# EAGLE design kicker (EAGLE 9.5.1)
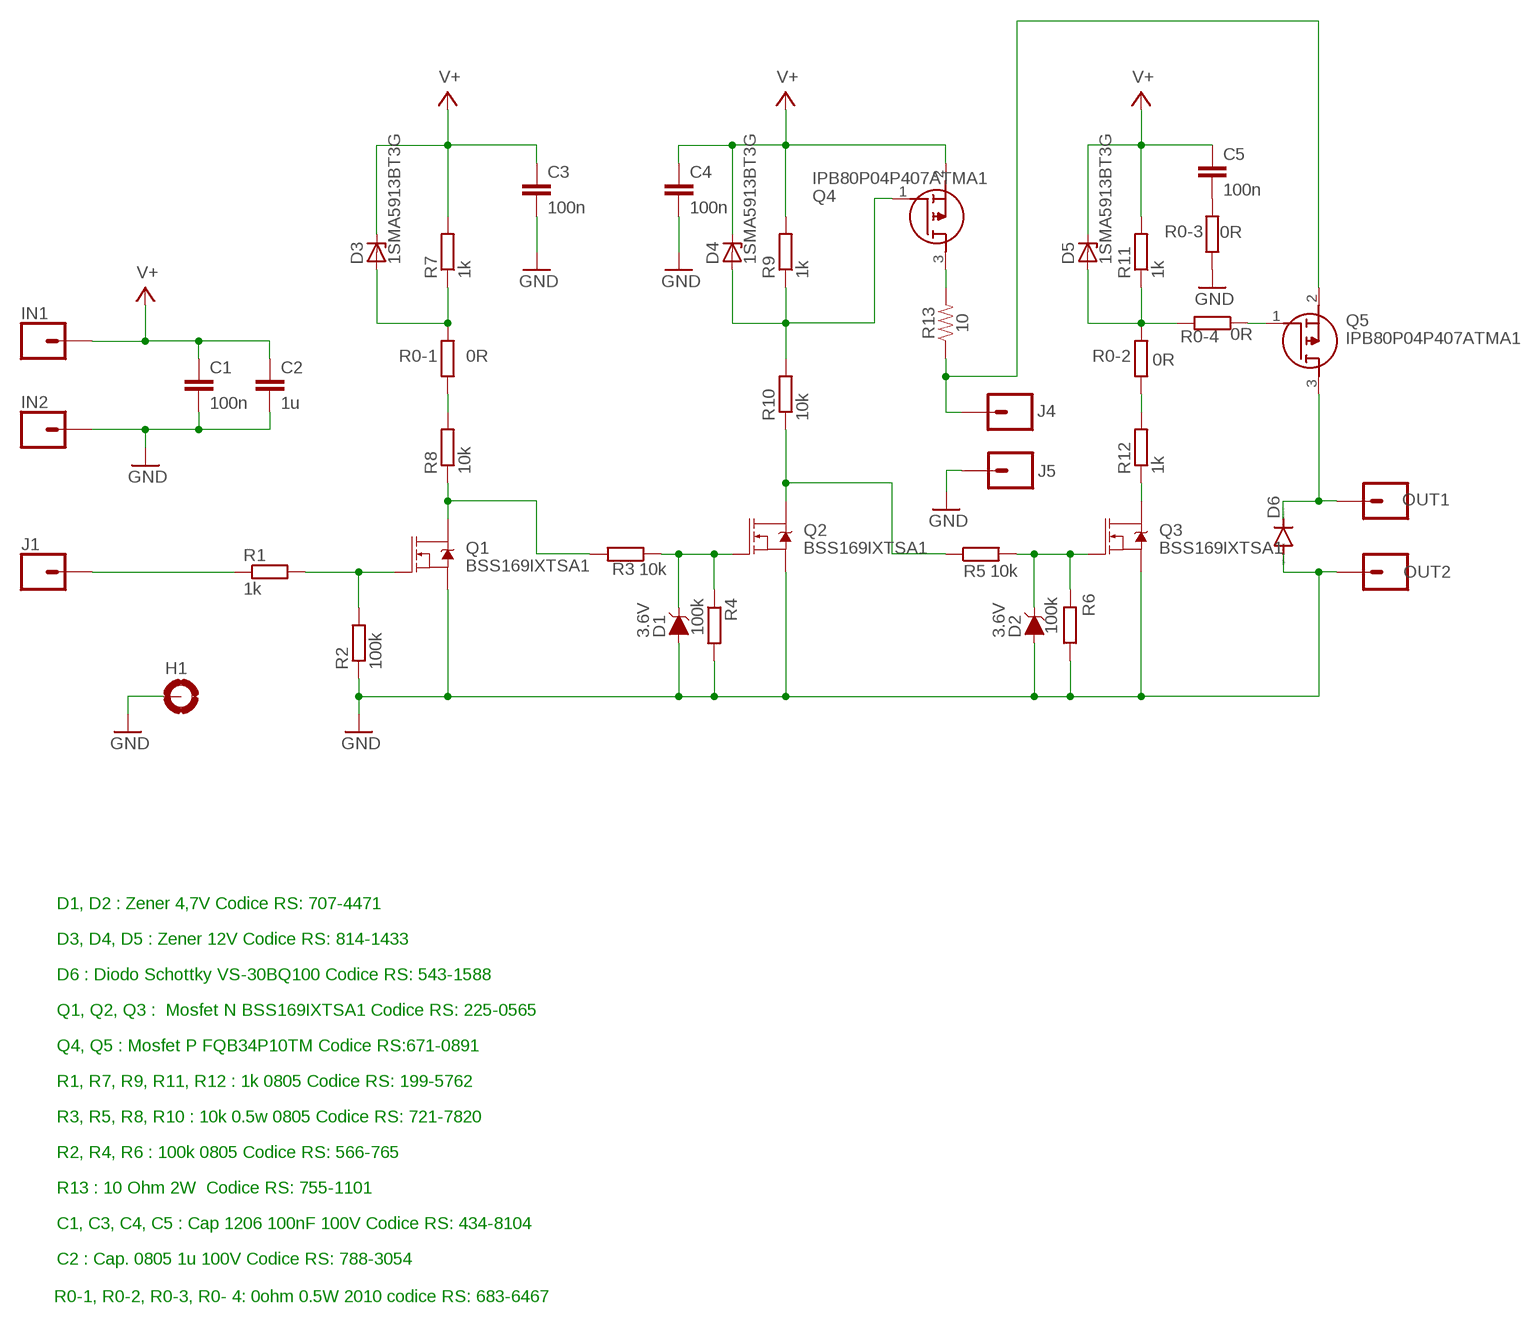
[diagram p0: schematic, sheet 1]

## Parts
C1  100n  C-EUC1206  [C1206]
C2  1u  C-EUC1206  [C1206]
C3  100n  C-EUC1206  [C1206]
C4  100n  C-EUC1206  [C1206]
C5  100n  C-EUC1206  [C1206]
D1  3.6V  DIODE-ZENER-BZT52C3V6S  [SOD-323]
D2  3.6V  DIODE-ZENER-BZT52C3V6S  [SOD-323]
D3  1SMA5913BT3G  [DO214AC]
D4  1SMA5913BT3G  [DO214AC]
D5  1SMA5913BT3G  [DO214AC]
D6  DIODE-SMC  [SMC]
H1  MOUNT-PAD-ROUND3.0  [3,0-PAD]
IN1  CONN_01  [1X01]
IN2  CONN_01  [1X01]
J1  CONN_01  [1X01]
J4  CONN_01  [1X01]
J5  CONN_01  [1X01]
OUT1  CONN_01  [1X01]
OUT2  CONN_01  [1X01]
Q1  BSS169IXTSA1  MOSFET-NCH-AO3404A  [SOT23-3]
Q2  BSS169IXTSA1  MOSFET-NCH-AO3404A  [SOT23-3]
Q3  BSS169IXTSA1  MOSFET-NCH-AO3404A  [SOT23-3]
Q4  IPB80P04P407ATMA1  [PG-TO263-3-2_1]
Q5  IPB80P04P407ATMA1  [PG-TO263-3-2_1]
R0-1  0R  R-EU_R2010  [R2010]
R0-2  0R  R-EU_R2010  [R2010]
R0-3  0R  R-EU_R2010  [R2010]
R0-4  0R  R-EU_R2010  [R2010]
R1  1k  R-EU_R1206  [R1206]
R2  100k  R-EU_R1206  [R1206]
R3  10k  R-EU_R1206  [R1206]
R4  100k  R-EU_R1206  [R1206]
R5  10k  R-EU_R1206  [R1206]
R6  100k  R-EU_R1206  [R1206]
R7  1k  R-EU_R1206  [R1206]
R8  10k  R-EU_R1206  [R1206]
R9  1k  R-EU_R1206  [R1206]
R10  10k  R-EU_R1206  [R1206]
R11  1k  R-EU_R1206  [R1206]
R12  1k  R-EU_R1206  [R1206]
R13  10  0.1OHM-1210-1/2W-1%  [1210]

## Nets
GND: C1.2 C2.2 C3.2 C4.2 D1.A D2.A D6.A H1.B3,0(MOUNT) IN2.1 J5.1 OUT2.1 Q1.2(S) Q2.2(S) Q3.2(S) R0-3.1 R2.1 R4.2 R6.1
N$1: J1.1 R1.1
N$2: Q1.1(G) R1.2 R2.2
N$3: D1.C Q2.1(G) R3.1 R4.1
N$4: D2.C Q3.1(G) R5.2 R6.2
N$5: Q1.3(D) R3.2 R8.1
N$6: R0-1.1 R8.2
N$7: Q2.3(D) R5.1 R10.1
N$8: D4.A Q4.1(G) R9.1 R10.2
N$9: Q4.3(D) R13.2
N$10: D3.A R0-1.2 R7.1
N$11: D6.C OUT1.1 Q5.3(D)
N$12: J4.1 Q5.2(S) R13.1
N$13: R0-2.1 R12.2
N$14: C5.2 R0-3.2
N$15: D5.A R0-2.2 R0-4.2 R11.1
N$16: Q3.3(D) R12.1
N$17: Q5.1(G) R0-4.1
V+: C1.1 C2.1 C3.1 C4.1 C5.1 D3.C D4.C D5.C IN1.1 Q4.2(S) R7.2 R9.2 R11.2

## Notes on the sheet
- D1, D2 : Zener 4,7V Codice RS: 707-4471
- D3, D4, D5 : Zener 12V Codice RS: 814-1433
- D6 : Diodo Schottky VS-30BQ100 Codice RS: 543-1588
- Q1, Q2, Q3 :  Mosfet N BSS169IXTSA1 Codice RS: 225-0565
- Q4, Q5 : Mosfet P FQB34P10TM Codice RS:671-0891
- R1, R7, R9, R11, R12 : 1k 0805 Codice RS: 199-5762
- R3, R5, R8, R10 : 10k 0.5w 0805 Codice RS: 721-7820
- R2, R4, R6 : 100k 0805 Codice RS: 566-765
- R13 : 10 Ohm 2W  Codice RS: 755-1101
- C1, C3, C4, C5 : Cap 1206 100nF 100V Codice RS: 434-8104
- C2 : Cap. 0805 1u 100V Codice RS: 788-3054
- R0-1, R0-2, R0-3, R0- 4: 0ohm 0.5W 2010 codice RS: 683-6467

## Library data of the parts
C1-C5 = rcl:C-EU: CAPACITOR, European symbol; SPICEPREFIX: C
D1 D2 = SparkFun-DiscreteSemi:DIODE-ZENER: Zener Diode A Zener diode allows current to flow from its anode to its cathode like a normal semiconductor diode, but it also permits current to flow in the reverse direction when its "Zener voltage" is reached. - WIkipedia; PROD_ID: DIO-08199
D3-D5 = 1sma59xx_10:1SMA59*BT3G: 1SMA59xxBT3G Series 1.5 Watt Plastic Surface Mount Zener Voltage Regulators Source: http://www.onsemi.com/pub_link/Collateral/1SMA5913BT3-D.PDF; MF: ON Semiconductor; MPN: 1SMA5913BT3G; OC_FARNELL: 1431138; OC_NEWARK: 26K5252
D6 = diode:DIODE-: DIODE
H1 = holes:MOUNT-PAD-ROUND: MOUNTING PAD, round
IN1 IN2 J1 J4 J5 OUT1 OUT2 = SparkFun-Connectors:CONN_01: Single connection point. Often used as Generic Header-pin footprint for 0.1 inch spaced/style header connections On any of the 0.1 inch spaced packages, you can populate with these: Break Away Headers - Straight <https://www.sparkfun.com/products/116> (PRT-00116) Break Away Male Headers - Right Angle <https://www.sparkfun.com/products/553> (PRT-00553) Female Headers <https://www.sparkfun.com/products/115> (PRT-00115) Break Away Headers - Machine Pin <https://www.sparkfun.com/products/117> (PRT-00117) Break Away Female Headers - Swiss Machine Pin <https://www.sparkfun.com/products/743> (PRT-00743) This device is also useful as a general connection point to wire up your design to another part of your project. Our various solder wires solder well into these plated through hole pads. Hook-Up Wire - Assortment (Stranded, 22 AWG) <https://www.sparkfun.com/products/11375> (PRT-11375) Hook-Up Wire - Assortment (Solid Core, 22 AWG) <https://www.sparkfun.com/products/11367> (PRT-11367) View the entire wire category on our website here <https://www.sparkfun.com/categories/141> Special notes: SMTSO-256-ET is a "flush mount" nut for a 4-40 screw. We mostly use this on specialty testbeds; it is a nice way to connect hardware to your PCB at an adjustable hieght. Also note, the SNAP packages are for using a snappable style connector. We sell a baggie of snaps and they are also used on two LilyPad designs: Snap Assortment - 30 pack (male and female) <https://www.sparkfun.com/products/11347> (DEV-11347) LilyPad Arduino SimpleSnap <https://www.sparkfun.com/products/10941> (DEV-10941) LilyPad SimpleSnap Protoboard <https://www.sparkfun.com/products/10940> (DEV-10940)
Q1-Q3 = SparkFun-DiscreteSemi:MOSFET-NCH: N-channel MOSFETs Voltage controlled devices that allow control of high current outputs. SparkFun Products: SparkFun OpenScale <https://www.sparkfun.com/products/13261> SparkFun Digital Sandbox <https://www.sparkfun.com/products/12651> SparkFun Monster Moto Shield <https://www.sparkfun.com/products/10182> SparkFun MOSFET Power Controller <https://www.sparkfun.com/products/11214>; PROD_ID: TRANS-12988; VALUE: 5.8A/30V/35mΩ
Q4 Q5 = IPB80P04P407ATMA1:IPB80P04P407ATMA1: Infineon IPB80P04P407ATMA1 P-channel MOSFET Transistor, 80 A, -40 V, 3-Pin TO-263 Source: Datasheet <http://uk.rs-online.com/web/p/products/8269487P>; DESCRIPTION: Infineon IPB80P04P407ATMA1 P-channel MOSFET Transistor, 80 A, -40 V, 3-Pin TO-263; HEIGHT: mm; MANUFACTURER_NAME: Infineon; MANUFACTURER_PART_NUMBER: IPB80P04P407ATMA1; RS_PART_NUMBER: 8269487P; RS_PRICE-STOCK: http://uk.rs-online.com/web/p/products/8269487P
R0-1-R0-4 R1-R12 = rcl:R-EU_: RESISTOR, European symbol; SPICEPREFIX: R
R13 = SparkFun-Resistors:0.1OHM: 0.1Ω resistor A resistor is a passive two-terminal electrical component that implements electrical resistance as a circuit element. Resistors act to reduce current flow, and, at the same time, act to lower voltage levels within circuits. - Wikipedia; PROD_ID: RES-12374; VALUE: 0.1

## Board
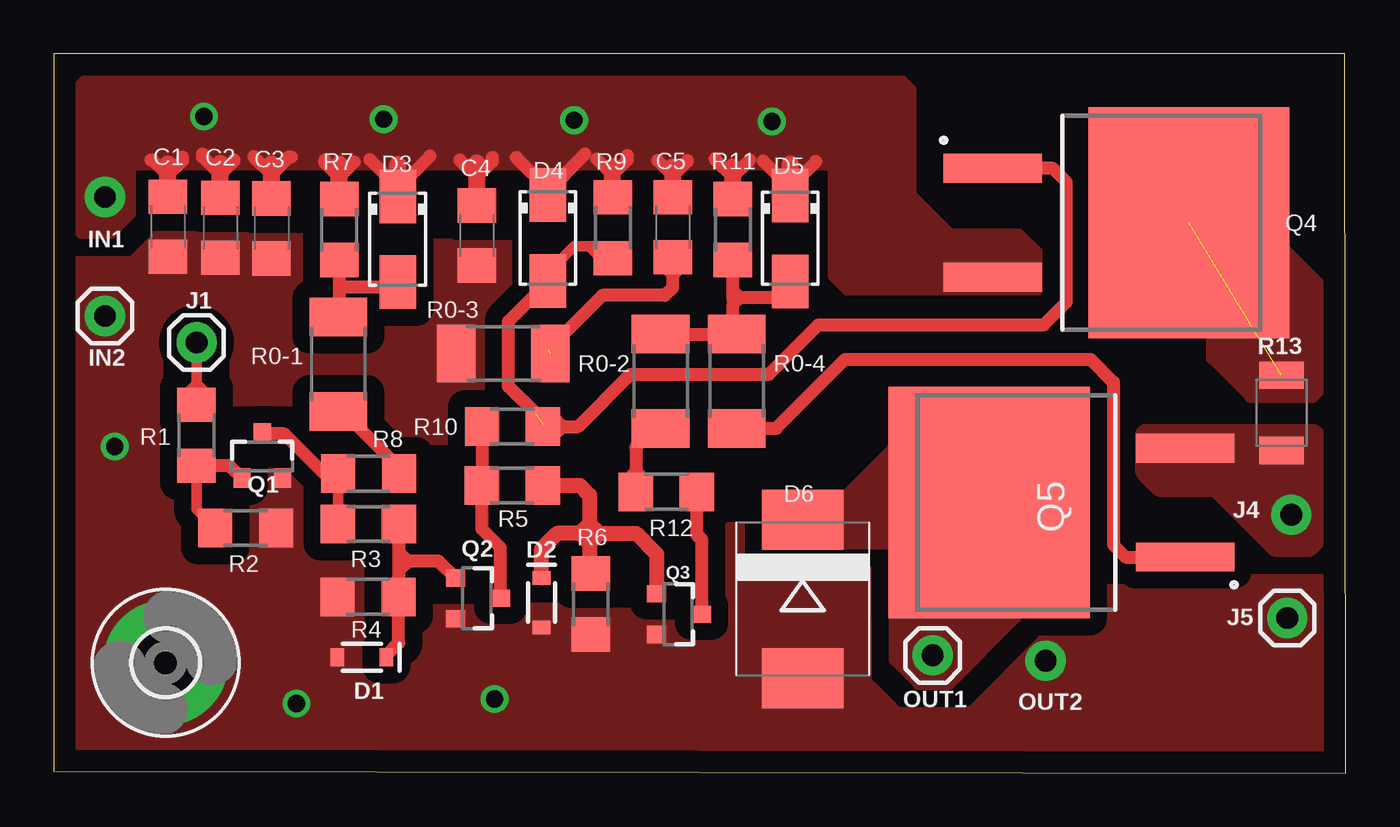
[diagram p1: board, top side]
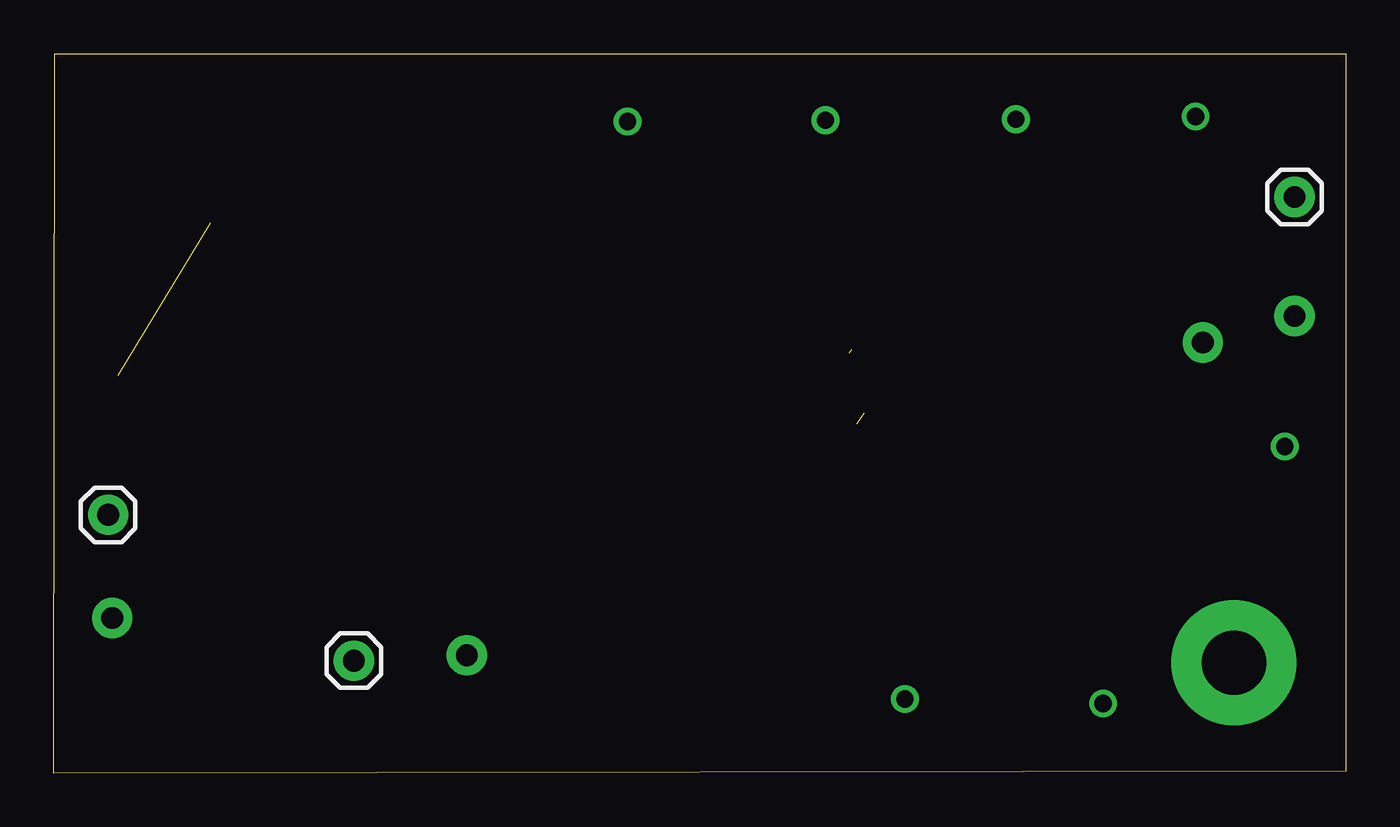
[diagram p2: board, bottom side, seen from below]

Size 60.35 x 33.6 mm. Coordinates in mm from the lower left corner, seen from the top.
Outline: 0,0.1 60.35,0 60.3,33.6 0,33.6 0,0.1
Copper layers (1*16): Top 0.035mm / dielectric 1.5mm / Bottom 0.035mm
Design rules "default": minimum track width 6mil, minimum drill 0.35mm, track to track 6mil, track to pad 6mil, pad to pad 6mil, via to via 6mil, smd to smd 6mil, copper to edge 40mil, drill to drill 6mil, minimum pad ring 10mil, minimum via ring 8mil, stop-mask expansion 4mil, vias tented up to drill 0mil, thermal gap 10mil

### Footprints (pad centres in the part's own frame; a part is rotated, then mirrored left to right if it is on the bottom)
C1206 = smd 1.6 x 1.8: 1 -1.4,0; 2 1.4,0
SOD-323 = smd 0.63 x 0.83: A 1.15,0; C -1.15,0
DO214AC = smd 2.5 x 1.7: A 2,0; C -2,0
SMC = smd 2.8 x 3.8: A 3.7,0; C -3.7,0
3,0-PAD = drill 3 pad 5.842: B3,0 0,0
1X01 = drill 1.016 pad 1.88: 1 0,0
SOT23-3 = smd 0.8 x 0.9: 1 -0.95,-1; 2 0.95,-1; 3 0,1.1
PG-TO263-3-2_1 = smd 1.35 x 4.6: 1 -2.54,-12.5; 2 2.54,-12.5 | smd 10.8 x 9.4: 3 0,-3.35
R2010 = smd 1.8 x 2.7: 1 -2.2,0; 2 2.2,0
R1206 = smd 1.6 x 1.803: 1 -1.422,0; 2 1.422,0
1210 = smd 1.27 x 2.06: 1 -1.755,0; 2 1.755,0

### Placement (x,y rotation side)
C1  5.34,25.52 270 top
C2  7.79,25.47 270 top
C3  10.18,25.44 270 top
C4  19.77,25.11 270 top
C5  28.92,25.49 270 top
D1  14.4,5.42 180 top
D2  22.79,7.97 270 top
D3  16.07,24.93 270 top
D4  23.08,24.99 270 top
D5  34.4,24.97 270 top
D6  34.98,8.15 270 top
H1  5.23,5.16 0 top
IN1  2.4,26.9 90 bottom
IN2  2.4,21.35 90 top
J1  6.68,20.11 0 top
J4  57.8,12.07 0 bottom
J5  57.61,7.25 0 top
OUT1  41.05,5.51 0 top
OUT2  46.33,5.26 0 bottom
Q1  9.75,14.79 0 top
Q2  19.77,8.17 270 top
Q3  29.16,7.43 270 top
Q4  56.36,25.7 270 top
Q5  40.33,12.64 90 top
R0-1  13.3,19.1 90 top
R0-2  28.35,18.3 90 top
R0-3  21,19.6 0 top
R0-4  31.9,18.3 90 top
R1  6.68,15.78 270 top
R2  8.97,11.45 180 top
R3  14.7,11.64 180 top
R4  14.69,8.24 180 top
R5  21.42,13.44 0 top
R6  25.09,7.91 90 top
R7  13.34,25.39 90 top
R8  14.71,13.99 0 top
R9  26.12,25.47 90 top
R10  21.43,16.19 0 top
R11  31.72,25.39 90 top
R12  28.61,13.14 180 top
R13  57.34,16.83 90 top

### Tracks (layer width: path | path; a pad name or v marks a point on that pad's centre or on a via)
GND  (via drill 0.8 pad 1.3)
  other vias: 11.34,3.26 20.6,3.47 2.86,15.26
  pour Top (isolate 0.8, rank 2, no thermals): -7.6,37.5 70.8,37.5 70.9,37.4 70.9,-5.3 -7.6,-5.3
N$1
  Top 0.5: J1.1 6.68,18.19 | R1.1 6.68,18.19 | 6.68,18.19 6.69,18.18 | 6.69,18.18 7.25,17.62 7.25,17.59 | 6.69,18.18 6.15,17.64
N$2
  Top 0.5: 8.9,13.69 Q1.1 | R1.2 6.68,12.32 R2.2
  Top 0.6: Q1.1 8.23,14.36 R1.2
N$3
  Top 0.5: R3.1 16.42,11.32 | 16.12,8.25 R4.1 | D1.C 15.55,5.52
  Top 0.6: 15.55,5.52 16.12,6.09 16.12,8.25 16.12,9.47 | R3.1 16.12,10.35 | 16.12,10.35 16.12,9.91 | 16.12,9.91 16.12,9.47 | Q2.1 17.98,9.91 16.56,9.91 | 16.56,9.91 16.12,9.91 | 16.56,9.91 16.12,9.47 | 16.56,9.91 16.12,10.35
N$4
  Top 0.5: D2.C | 25.1,9.34 R6.2
  Top 0.7: D2.C 22.79,10.49 23.5,11.2 24.59,11.2 | 24.59,11.2 25,11.2 | 25,11.2 25.49,11.2 | 25.49,11.2 27.2,11.2 28.16,10.24 Q3.1 | R6.2 25.04,9.38 25.04,10.75 | 25.04,10.75 25.04,11.16 | 25.04,11.16 25,11.2 | 25.04,10.75 25.49,11.2 | 25.04,10.75 24.59,11.2 | 22.84,13.29 R5.2 24.59,13.44 25.04,12.99 25.04,11.65 | 25.04,11.65 25.04,11.16 | 24.59,11.2 25.04,11.65 | 25.04,11.65 25.49,11.2
N$5
  Top 0.5: R3.2 13.11,11.81 13.11,11.97 13.29,12.15 R8.1
  Top 0.6: Q1.3 9.79,15.85 10.78,15.85 12.64,13.99 R8.1
N$6
  Top 0.5: R0-1.1 13.5,16.9 | 16.13,14.27 R8.2
  Top 0.6: 16.13,14.27 13.5,16.9
N$7
  Top 0.6: R10.1 R5.1 | R5.1 | R5.1 20,11.4 20.87,10.53 Q2.3
N$8  (1 unrouted)
  Top 0.4: 26.12,24.6 R9.1
  Top 0.5: 23.1,22.97 D4.A | D4.A 23.1,22.97 | D4.A 23.18,22.89 23.18,22.79 | 22.85,16.29 R10.2 23.85,16.19 | D4.A 23.08,23.38 24.3,24.6 25,24.6 | 25,24.6 26.12,24.6 | 23.85,16.19 23.35,15.69 23.35,15.6 | 23.85,16.19 23.35,16.69 23.35,16.8 | 25,24.6 25.6,24 25.6,23.9
  Top 0.6: Q4.1 46.66,28.24 47.29,27.61 47.29,21.99 46.24,20.94 35.71,20.94 33.4,18.63 26.93,18.63 24.49,16.19 23.85,16.19 | D4.A 23.08,22.94 21.23,21.09 21.23,18.07 22.5,16.8
N$9  (1 unrouted)
  pour Top (no thermals): 54.9,20.7 56.3,24.6 54.9,23.2
  pour Top (no thermals): 55.9,17.6 58.8,17.6 59.1,17.9 59.1,22.8 56.9,25 54.1,25 54.1,19.4
N$10
  Top 0.5: 13.34,21.34 R0-1.2
  Top 0.6: R7.1 13.34,22.7 | 13.34,22.7 13.34,21.34 | D3.A 15.84,22.7 13.34,22.7
N$11
  pour Top (no thermals): 41.8,4.2 44.9,7.3 44.9,8 43.8,9.1 39.6,9.1 39.28,8.78 39.28,5.32 40.4,4.2
  pour Top (no thermals): 36,11.93 40.13,16.06 41.77,16.06 42.77,15.06 42.77,11.91 41.61,10.75 36,10.75
N$12
  pour Top (no thermals): 51,15.8 51,14.1 51.7,13.4 54.3,13.4 57.1,10.6 58.6,10.6 59.6,11.6 59.6,15 58.8,15.8
N$13
  Top 0.6: R12.2 27.19,14.1 | 28,16.1 R0-2.1 28.07,16.1 27.19,15.22 27.19,14.1 | 27.19,14.1 27.59,13.7 27.6,13.7 | 27.19,14.1 26.75,13.66 26.75,13.65
N$14  (1 unrouted)
  Top 0.5: C5.2 28.92,23.2 | 28.92,23.2 28.57,23.55 28.4,23.55 | 28.92,23.2 29.27,23.55 29.45,23.55
  Top 0.6: 28.92,23.2 28.92,22.69 28.54,22.31 25.63,22.31 23.09,19.77
N$15
  Top 0.5: R0-4.2 31.72,20.68 | D5.A 33.63,22.2 | 32.1,22.2 31.72,22.2 31.67,22.2 31.67,21.77 31.72,21.82 32.1,22.2 | 31.72,22.6 32.1,22.22 32.1,22.2
  Top 0.6: 31.72,20.68 31.72,21.82 | 31.72,22.2 31.72,22.6 R11.1 | 33.63,22.2 32.1,22.2 | R0-2.2 R0-4.2
N$16
  Top 0.5: 30,13.11 R12.1
  Top 0.6: R12.1 30.03,11.15 30.26,10.92 Q3.3
N$17
  Top 0.6: R0-4.1 33.74,16.1 36.96,19.32 48.43,19.32 49.49,18.26 49.49,10.68 50.07,10.1 Q5.1
V+  (via drill 0.8 pad 1.3)
  Top 0.5: 10.18,28.45 10.2,28.45 | 19.6,28.5 19.77,28.5 19.95,28.5
  Top 0.6: 4.55,28.63 4.63,28.63 5.34,27.92 6.02,28.6 6.02,28.76 | 6.96,28.91 6.96,28.78 7.79,27.95 8.43,28.59 8.43,28.63 | 11.1,28.76 11,28.76 10.18,27.94 10.18,27.96 9.35,28.79 | 12.67,28.62 12.67,28.5 13.34,27.83 14.04,28.53 | 20.5,28.75 20.5,28.57 19.77,27.84 18.98,28.63 18.98,28.64 | 26.78,28.84 26.78,28.62 26.1,27.94 25.36,28.68 | 28.22,28.6 28.92,27.9 29.58,28.56 29.58,28.61 | 30.89,28.71 30.89,28.67 31.72,27.84 31.73,27.84 32.51,28.62 | 17.58,28.81 16.07,27.3 D3.C 16.07,27.35 14.76,28.66 | 24.8,28.9 23.08,27.18 D4.C 23.08,27.28 21.62,28.74 | 35.6,28.56 34.4,27.36 D5.C 34.4,27.32 33.13,28.59
  Top 0.8: C1.1 5.34,27.92 5.34,28.45 | C2.1 7.79,27.95 7.79,28.46 | C3.1 10.18,27.94 10.18,28.45 | R7.2 13.34,27.83 13.34,28.45 | C4.1 19.77,27.84 19.77,28.5 | 26.1,28.3 26.1,27.94 26.1,26.91 R9.2 | C5.1 28.92,27.9 28.92,28.3 | R11.2 31.72,27.84 31.72,28.3 | D5.C 34.4,28.45 | D3.C 16.07,28.41
  other vias: 7.02,30.66 15.41,30.54 33.55,30.43 24.3,30.48
  pour Top (isolate 0.8, no thermals): 1.3,25.2 0.5,26 0.5,31.4 2,32.9 39.08,32.9 40.06,31.92 40.06,27.02 41.88,25.2 45.08,25.2 45.98,24.3 45.98,22.54 37.06,22.54 36.4,23.2 36.4,28.39 3.79,28.39 3.6,28.2 3.6,26.1 2.7,25.2

### Text on the board
tNames: R0-2 | R0-4